# EAGLE design USB2Serial_MCP2200_v1.0 (EAGLE 9.6.2)
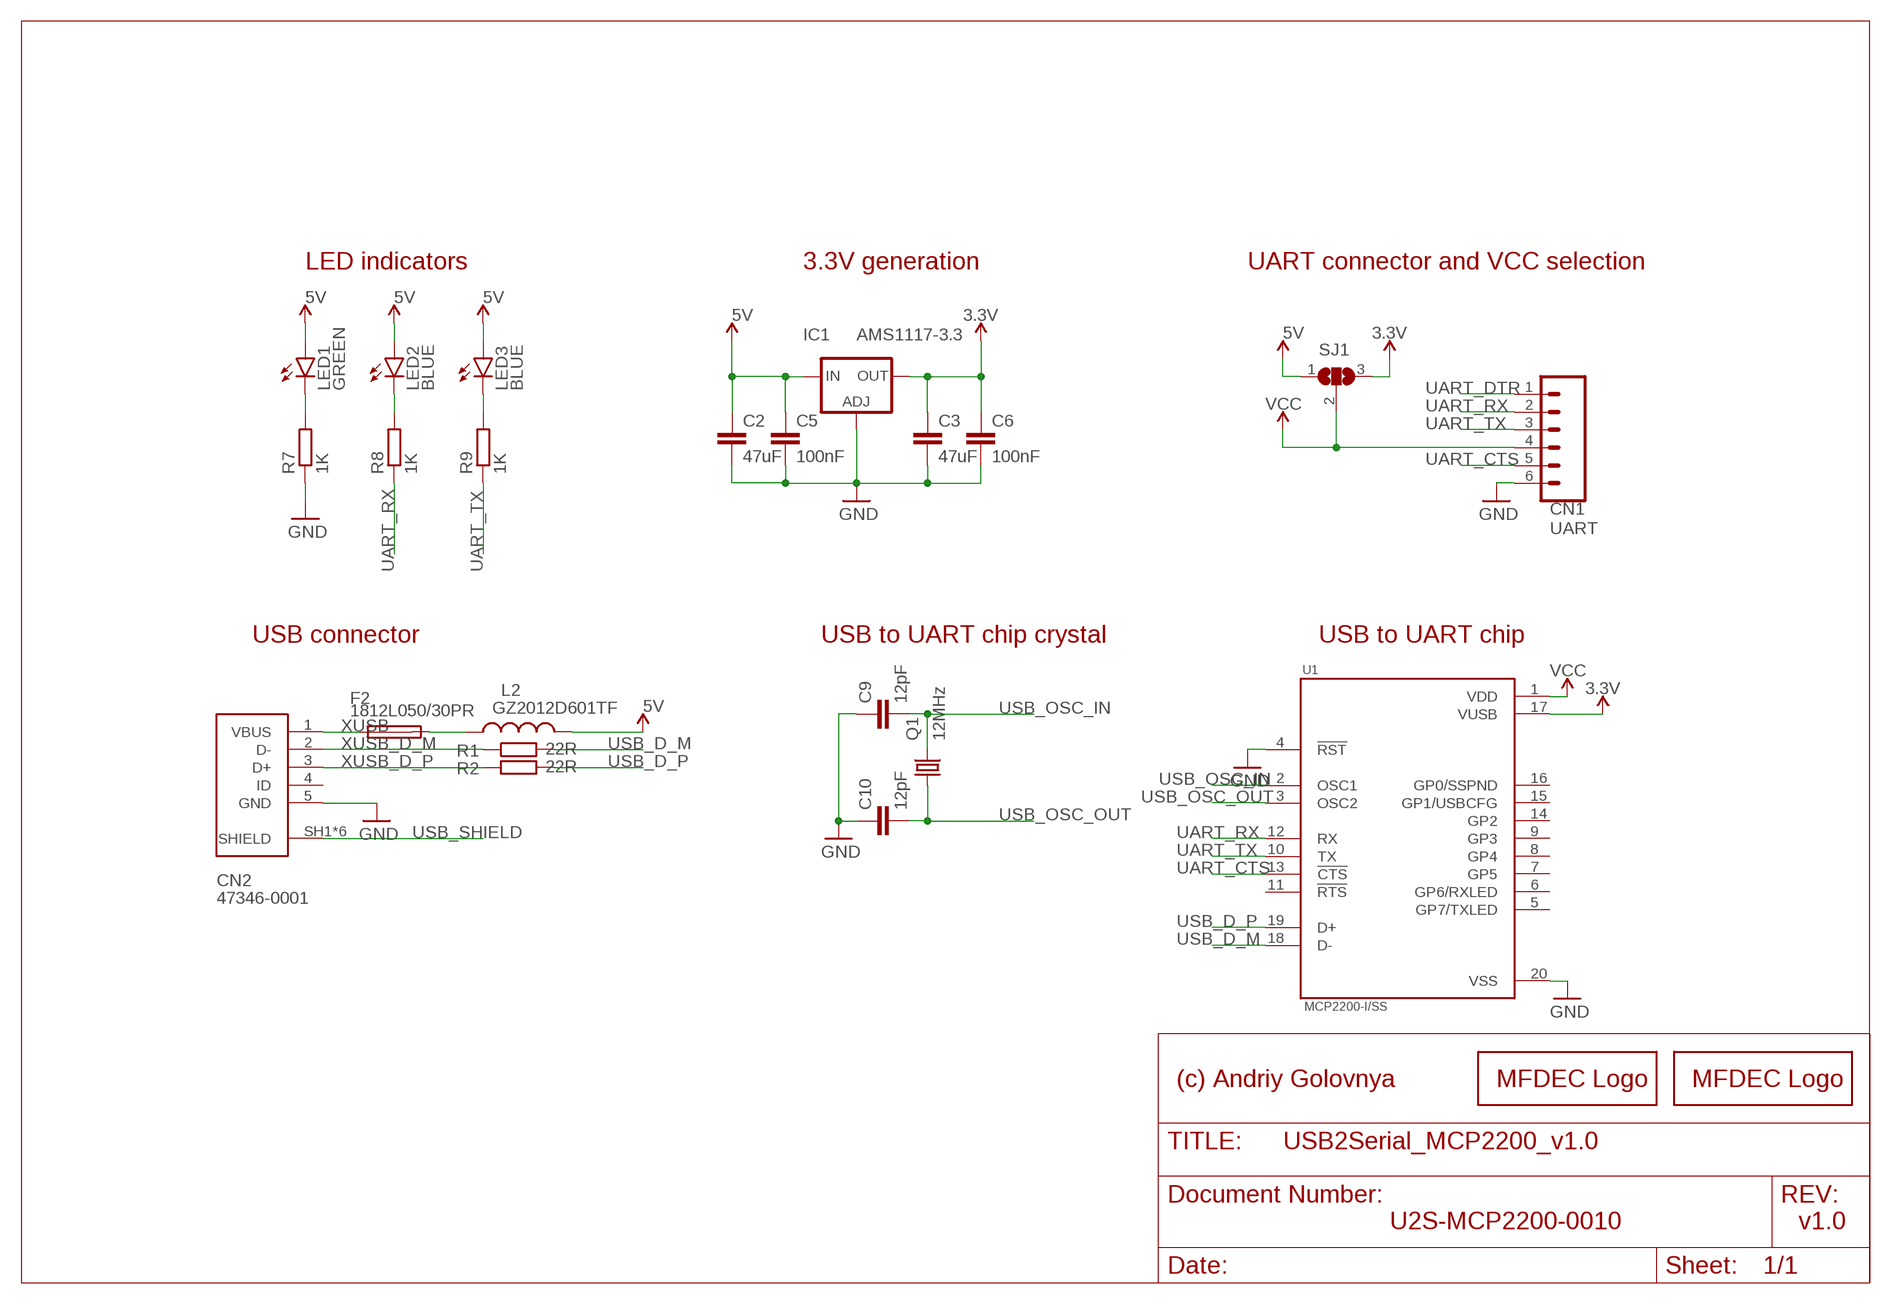
[diagram p0: schematic, sheet 1]

## Parts
C2  47uF  C-EUC0805  [C0805]
C3  47uF  C-EUC0805  [C0805]
C5  100nF  C-EUC0402  [C0402]
C6  100nF  C-EUC0402  [C0402]
C9  12pF  C-EUC0402  [C0402]
C10  12pF  C-EUC0402  [C0402]
CN1  UART  CONN_06LOCK  [1X06_LOCK]
CN2  47346-0001  [MOLEX_47346-0001]
F2  1812L050/30PR  MF-SMDF050  [MF-SMDF050]
IC1  AMS1117-3.3  LD117AS33TR  [SOT223]
L2  GZ2012D601TF  WE-CBA_0805_782853102_HC  [WE-CBA_0805(W=4)]
LED1  GREEN  LEDSML0603  [SML0603]
LED2  BLUE  LEDSML0603  [SML0603]
LED3  BLUE  LEDSML0603  [SML0603]
LOGO1  MFDECLOGO_L_20MM  [MFDEC_L_20MM]
LOGO2  MFDECLOGO_SQ_10MM  [MFDEC_SQ_10MM]
Q1  12MHz  KX-7  [3.2X2.5_KX-7]
R1  22R  R-EU_R0402  [R0402]
R2  22R  R-EU_R0402  [R0402]
R7  1K  R-EU_R0402  [R0402]
R8  1K  R-EU_R0402  [R0402]
R9  1K  R-EU_R0402  [R0402]
SJ1  SJ2FI  [SJ_2FI]
U1  MCP2200-I/SS  [SOP65P780X200-20N]

## Nets
3.3V [POWER]: C3.1 C6.1 IC1.4(OUT) SJ1.3 U1.17(VUSB)
5V [POWER]: C2.1 C5.1 IC1.3(IN) L2.2 LED1.A LED2.A LED3.A SJ1.1
GND [POWER]: C2.2 C3.2 C5.2 C6.2 C9.1 C10.1 CN1.6 CN2.5(GND) IC1.1(ADJ) R7.1 U1.4(!RST) U1.20(VSS)
N$4: F2.2 L2.1
N$7: LED1.C R7.2
N$9: LED3.C R9.2
N$10: LED2.C R8.2
UART_CTS: CN1.5 U1.13(!CTS)
UART_DTR: CN1.1
UART_RX: CN1.2 R8.1 U1.12(RX)
UART_TX: CN1.3 R9.1 U1.10(TX)
USB_D_M [USB]: R1.2 U1.18(D-)
USB_D_P [USB]: R2.2 U1.19(D+)
USB_OSC_IN: C9.2 Q1.3 U1.2(OSC1)
USB_OSC_OUT: C10.2 Q1.1 U1.3(OSC2)
USB_SHIELD: CN2.SH1(SHIELD) CN2.SH2(SHIELD) CN2.SH3(SHIELD) CN2.SH4(SHIELD) CN2.SH5(SHIELD) CN2.SH6(SHIELD)
VCC: CN1.4 SJ1.2 U1.1(VDD)
XUSB [POWER]: CN2.1(VBUS) F2.1
XUSB_D_M [XUSB]: CN2.2(D-) R1.1
XUSB_D_P [XUSB]: CN2.3(D+) R2.1
Unconnected: CN2.4(ID) U1.5(GP7/TXLED) U1.6(GP6/RXLED) U1.7(GP5) U1.8(GP4) U1.9(GP3) U1.11(!RTS) U1.14(GP2) U1.15(GP1/USBCFG) U1.16(GP0/SSPND)

## Notes on the sheet
- LED indicators | 3.3V generation | UART connector and VCC selection
- USB connector | USB to UART chip crystal | USB to UART chip
- (c) Andriy Golovnya
- U2S-MCP2200-0010 | v1.0

## Library data of the parts
C2 C3 C5 C6 C9 C10 = rcl:C-EU: CAPACITOR, European symbol; SPICEPREFIX: C
CN1 = _my_locked_connectors:CONN_06: Multi connection point. Often used as Generic Header-pin footprint for 0.1 inch spaced/style header connections On any of the 0.1 inch spaced packages, you can populate with these: Break Away Headers - Straight <https://www.sparkfun.com/products/116> (PRT-00116) Break Away Male Headers - Right Angle <https://www.sparkfun.com/products/553> (PRT-00553) Female Headers <https://www.sparkfun.com/products/115> (PRT-00115) Break Away Headers - Machine Pin <https://www.sparkfun.com/products/117> (PRT-00117) Break Away Female Headers - Swiss Machine Pin <https://www.sparkfun.com/products/743> (PRT-00743) Arduino Stackable Header - 6 Pin <https://www.sparkfun.com/products/9280> (PRT-09280) For SCREWTERMINALS and SPRING TERMINALS visit here: Screw Terimnals on SparkFun.com <https://www.sparkfun.com/search/results?term=Screw+Terminals> (5mm/3.5mm/2.54mm spacing) This device is also useful as a general connection point to wire up your design to another part of your project. Our various solder wires solder well into these plated through hole pads. Hook-Up Wire - Assortment (Stranded, 22 AWG) <https://www.sparkfun.com/products/11375> (PRT-11375) Hook-Up Wire - Assortment (Solid Core, 22 AWG) <https://www.sparkfun.com/products/11367> (PRT-11367) View the entire wire category on our website here <https://www.sparkfun.com/categories/141>
CN2 = SnapEDA-Library:47346-0001: CONN RCPT 5POS MICRO USB R/A SMD; MANUFACTURER: Molex
F2 = fuse:MF-SMDF: MF-SMDF Series - PRC Resettable Fuses Source: http://www.farnell.com/datasheets/716597.pdf
IC1 = v-reg:LD117A?*: Low drop fixed and adjustable positive voltage regulators 1 A Source: http://www.st.com/stonline/products/literature/ds/7194/ld1117axx.pdf
L2 = Wurth_Automotive_WE-CBA:WE-CBA_0805: WE-CBA SMD EMI Suppression Ferrite Bead Characteristics Reliable Ni-Sn electrodes High rated current up to 5A Recommended soldering: Reflow Operating temperature: -55°C to +125°C Applications * Perfect as data line filter and for uncoupling of distribution voltage *This special SMD chip bead ferrites can be put directly on the printed circuit board. They offer excellent anti-EMI properties and low DC-resistance. Placed very close next to the interference source even with smallest size 0402,maximal impedance at 1000 Ω can be reached. *High Speed: "High Speed " SMD ferrites WE-CBF have lower impedance in the lower frequency ranges thus they have only a low attenuation for fast signals. Application e.g. USB 2.0, IEEE 1394,LVDS *Wide Band: "Wide Band" SMD ferrites WE-CBF already show high impedance in low frequency range. Therefore they are wide band through the whole spectrum. Application e.g. control signats, RS232, RS422, DC/DC converter *High Current: "High Current " SMD ferrites WE-CBF are designed for high current (over 1 A). The rated current refers to 40K self-heating. High current SMD ferrites are available in all there types (High Speed, Wide Band and High Frequency). Application e.g. power supply, DC/DC converter *Advice: Pay attention for the use of SMD-Ferrites for high current>1A and ambient temperature over +85°C that the rated current has to be reduced when temperature is above +85°C (Derating). *At+100°C environment temperature the maximal rated current has to add up to only 60% of the data sheet value ,without an overload of the component. Variant abbreviation WB means WIDE BAND HS means HIGH SPEED HC means HIGH CURRENT <https://katalog.we-online.de/media/images/v2/o14751v209%20Family_WE-CBA.jpg> Details see: https://www.we-online.com/catalog/en/WE-CBA/ Updated by Ella Wu 2019-11-20 2019(C) Wurth Elektronik; DATASHEET-URL: https://www.we-online.com/catalog/datasheet/782853102.pdf; IR1: 1000mA; MOUNT: SMT; PART-NUMBER: 782853102; RDC-MAX: 0.3Ohm; TYPE: High Current; VALUE: 1000Ohm@100MHz; ZMAX: 1000Ohm
LED1-LED3 = led:LED: LED OSRAM: - CHIPLED LG R971, LG N971, LY N971, LG Q971, LY Q971, LO R971, LY R971 LH N974, LH R974 LS Q976, LO Q976, LY Q976 LO Q996 - Hyper CHIPLED LW Q18S LB Q993, LB Q99A, LB R99A - SideLED LS A670, LO A670, LY A670, LG A670, LP A670 LB A673, LV A673, LT A673, LW A673 LH A674 LY A675 LS A676, LA A676, LO A676, LY A676, LW A676 LS A679, LY A679, LG A679 - Hyper Micro SIDELED® LS Y876, LA Y876, LO Y876, LY Y876 LT Y87S - SmartLED LW L88C, LW L88S LB L89C, LB L89S, LG L890 LS L89K, LO L89K, LY L89K LS L896, LA L896, LO L896, LY L896 - TOPLED LS T670, LO T670, LY T670, LG T670, LP T670 LSG T670, LSP T670, LSY T670, LOP T670, LYG T670 LG T671, LOG T671, LSG T671 LB T673, LV T673, LT T673, LW T673 LH T674 LS T676, LA T676, LO T676, LY T676, LB T676, LH T676, LSB T676, LW T676 LB T67C, LV T67C, LT T67C, LS T67K, LO T67K, LY T67K, LW E67C LS E67B, LA E67B, LO E67B, LY E67B, LB E67C, LV E67C, LT E67C LW T67C LS T679, LY T679, LG T679 LS T770, LO T770, LY T770, LG T770, LP T770 LB T773, LV T773, LT T773, LW T773 LH T774 LS E675, LA E675, LY E675, LS T675 LS T776, LA T776, LO T776, LY T776, LB T776 LHGB T686 LT T68C, LB T68C - Hyper Mini TOPLED® LB M676 - Mini TOPLED Santana® LG M470 LS M47K, LO M47K, LY M47K Source: http://www.osram.convergy.de LUXEON: - LUMILED® LXK2-PW12-R00, LXK2-PW12-S00, LXK2-PW14-U00, LXK2-PW14-V00 LXK2-PM12-R00, LXK2-PM12-S00, LXK2-PM14-U00 LXK2-PE12-Q00, LXK2-PE12-R00, LXK2-PE12-S00, LXK2-PE14-T00, LXK2-PE14-U00 LXK2-PB12-K00, LXK2-PB12-L00, LXK2-PB12-M00, LXK2-PB14-N00, LXK2-PB14-P00, LXK2-PB14-Q00 LXK2-PR12-L00, LXK2-PR12-M00, LXK2-PR14-Q00, LXK2-PR14-R00 LXK2-PD12-Q00, LXK2-PD12-R00, LXK2-PD12-S00 LXK2-PH12-R00, LXK2-PH12-S00 LXK2-PL12-P00, LXK2-PL12-Q00, LXK2-PL12-R00 Source: www.luxeon.com KINGBRIGHT: KA-3528ASYC Source: www.kingbright.com
LOGO1 LOGO2 = _my_logos:MFDECLOGO: Midnight Fog - Digital Eye Candy LOGO
Q1 = crystal-geyer_V1_0:KX: Quartz Crystals (MHz) SMD: KX - Serie Model Size l/w/h [mm] Frequency Range Frequency Stability Temp. Range [°C] Load Capacitance AECQ 200 availabel Datasheet KX-4 KX-5 KX-6 KX-7 KX-9A KX-9B KX-12A KX-12B KX-13 KX-20 KX-K KX-KS 1.6/1.2/0.3 2.0/1.6/0.45 2.5/2.0/0.55 3.2/2.5/0.8 5.0/3.2/1.0 5.0/3.2/1.1 6.0/3.5/1.1 6.0/3.5/1.0 7.0/5.0 /1.3 11.6/5.5/1.6 12.3/4.5/4.2 12.3/4.5/3.2 24.0 ~ 80.0 MHz 16.0 ~ 80.0 MHz 12.0 ~ 80.0 MHz 8.0 ~ 60.0 MHz 7,68 ~ 300,0 MHz 8,0 ~ 50,0 MHz 8,0 ~ 150,0 MHz 8,0 ~ 50,0 MHz 6,0 ~ 160,0 MHz 3,579 ~ 25,0 MHz 3,579 ~ 70,0 MHz 3,579 ~ 70,0 MHz ±10 … ±50ppm ±10 … ±50ppm ±10 … ±50ppm ±10 … ±50ppm ±10 … ±50ppm ±10 … ±50ppm ±10 … ±50ppm ±10 … ±50ppm ±10 … ±50ppm ±50ppm ±10 … ±50ppm ±10 … ±50ppm (*) -40°C …+85°C (*) -40°C …+125°C (*) -40°C …+125°C (*) -40°C …+125°C (*) -40°C …+105°C (*) -40°C …+105°C (*) -40°C …+125°C (*) -40°C …+105°C (*) -40°C …+105°C (*) -40°C …+105°C (*) -40°C …+85°C (*) -40°C …+85°C 8, 8…16 8, 8…16 10, 8…16 12, 7…20 16, 10…20 16, 10…20 16, 10…20 16, 12…20 16, 12…20 16, 12…20 16, 12…30 16, 12…30 - yes yes yes - - - - - - - - KX-4.pdf <http://www.geyer-electronic.de/uploads/tx_userartikelfrequenz/GEYER-KX-4.pdf> KX-5.pdf <http://www.geyer-electronic.de/uploads/tx_userartikelfrequenz/GEYER-KX-5.pdf> KX-6.pdf <http://www.geyer-electronic.de/uploads/tx_userartikelfrequenz/GEYER-KX-6.pdf> KX-7.pdf <http://www.geyer-electronic.de/uploads/tx_userartikelfrequenz/GEYER-KX-7.pdf> KX-9A.pdf <http://www.geyer-electronic.de/uploads/tx_userartikelfrequenz/GEYER-KX-9A.pdf> KX-9B.pdf <http://www.geyer-electronic.de/uploads/tx_userartikelfrequenz/GEYER-KX-9B.pdf> KX-12A.pdf <http://www.geyer-electronic.de/uploads/tx_userartikelfrequenz/GEYER-KX-12A.pdf> KX-12B.pdf <http://www.geyer-electronic.de/uploads/tx_userartikelfrequenz/GEYER-KX-12B.pdf> KX-13.pdf <http://www.geyer-electronic.de/uploads/tx_userartikelfrequenz/GEYER-KX-13.pdf> KX-20.pdf <http://www.geyer-electronic.de/uploads/tx_userartikelfrequenz/GEYER-KX-20.pdf> KX-K.pdf <http://www.geyer-electronic.de/uploads/tx_userartikelfrequenz/GEYER-KX-K.pdf> KX-KS.pdf <http://www.geyer-electronic.de/uploads/tx_userartikelfrequenz/GEYER-KX-KS.pdf> <http://www.geyer-electronic.de/fileadmin/template/img/logo-geyer-electronic.png> Details see: http://www.geyer-electronic.de/Frequenz-Produkte.9.0.html Created 2016-06-07, Hans Locher 2016 (C) Geyer Quartz Technology KX4,KX5,KX6,KX7,KX9A,KX9B,KX12A,KX12B,KX13,KX20,KXK,KXKS;1612;2016;2520;3225;5032;6035;7050;11655;12345;1,6x1,2;2,0x1,6;2,5x2,0;3,2x2,5;5,0x3,2;6,0x3,5;7,0x5,0;11,6x5,5;12,3x4,5;12,3x4,5;1.6x1.2;2.0x1.6;2.5x2.0;3.2x2.5;5.0x3.2;6.0x3.5;7.0x5.0;11.6x5.5;12.3x4.5;12.3x4.5;
R1 R2 R7-R9 = rcl:R-EU_: RESISTOR, European symbol; SPICEPREFIX: R
SJ1 = _my_jumpers:SJ2: SMD solder JUMPER SJ2 - simple jumper SJ2FI - fancy inside jumper SJ2FO - fancy outside jumper SJ2FL - fancy left jumper SJ2FR - fancy right jumper SJ2W - wide jumper
U1 = MCP2200-I_SS:MCP2200-I: MCP2200 Series 5.5 V 8 Channel USB to UART Serial Converter SMT- SSOP-20LD Check availability <https://pricing.snapeda.com/parts/MCP2200-I/SS/Microchip/view-part?ref=eda>; AVAILABILITY: In Stock; DESCRIPTION: USB Bridge, USB to UART USB 2.0 UART Interface 20-SSOP; MF: Microchip; MP: MCP2200-I/SS; PACKAGE: SSOP-20 Microchip; PRICE: None; PURCHASE-URL: https://pricing.snapeda.com/search/part/MCP2200-I/SS/?ref=eda

## Net classes
1 XUSB: width 0.305 mm
2 USB: width 0.305 mm
3 POWER: width 0.305 mm

## Board
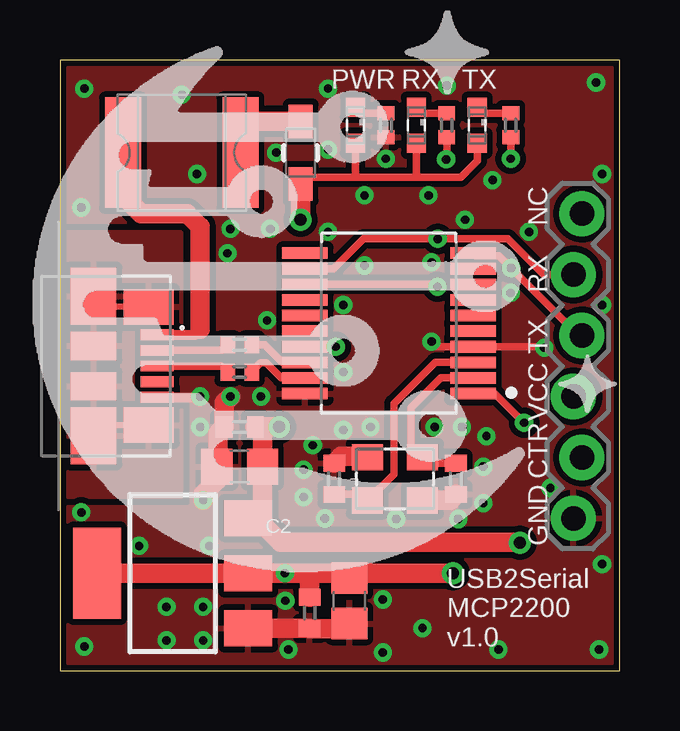
[diagram p1: board, top side]
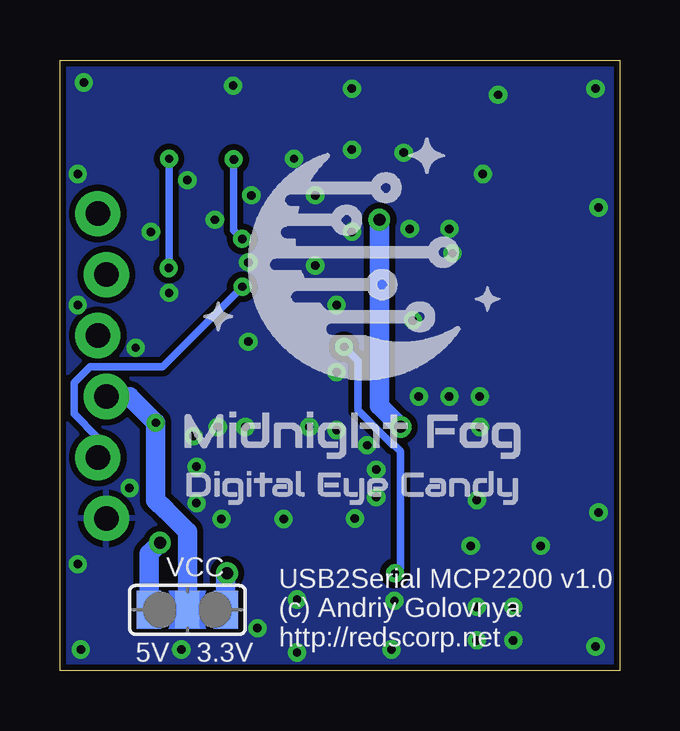
[diagram p2: board, bottom side, seen from below]

Size 23.35 x 25.45 mm. Coordinates in mm from the lower left corner, seen from the top.
Outline: 0,0 23.35,0 23.35,25.45 0,25.45 0,0
Copper layers (1*16): Top 0.035mm / dielectric 1.5mm / Bottom 0.035mm
Design rules "default *": minimum track width 6mil, minimum drill 0.35mm, track to track 6mil, track to pad 6mil, pad to pad 6mil, via to via 6mil, smd to smd 6mil, copper to edge 10mil, drill to drill 6mil, minimum pad ring 10mil, minimum via ring 8mil, stop-mask expansion 4mil, vias tented up to drill 20mil, thermal gap 10mil

### Footprints (pad centres in the part's own frame; a part is rotated, then mirrored left to right if it is on the bottom)
C0805 = smd 1.3 x 1.5: 1 -0.95,0; 2 0.95,0
C0402 = smd 0.7 x 0.9: 1 -0.65,0; 2 0.65,0
1X06_LOCK = drill 1.016 pad 1.88: 1 0,0.178; 2 2.54,-0.178; 3 5.08,0.178; 4 7.62,-0.178; 5 10.16,0.178; 6 12.7,-0.178
MOLEX_47346-0001 = smd 0.45 x 1.38: 1 -1.3,2.66; 2 -0.65,2.66; 3 0,2.66; 4 0.65,2.66; 5 1.3,2.66 | smd 1.475 x 2.1: SH1 -2.462,2.3; SH2 2.462,2.3 | smd 2.375 x 1.9: SH3 -2.913,0; SH6 2.913,0 | smd 1.175 x 1.9: SH4 -0.838,0; SH5 0.838,0
MF-SMDF050 = smd 1.5 x 4.6: 1 -2.45,0; 2 2.45,0
SOT223 = smd 1.5 x 2: 1 -2.3,-3.15; 2 0,-3.15; 3 2.3,-3.15 | smd 3.8 x 2: 4 0,3.15
WE-CBA_0805(W=4) = smd 1.4 x 1: 1 -1.3,0; 2 1.3,0
SML0603 = smd 0.8 x 0.8: A 0.75,0; C -0.75,0
3.2X2.5_KX-7 = smd 1.3 x 1.1: 1 -1.15,-0.9; 2 1.15,-0.9; 3 1.15,0.9; 4 -1.15,0.9
R0402 = smd 0.6 x 0.7: 1 -0.5,0; 2 0.5,0
SJ_2FI = smd 1.016 x 1.575: 1 -1.6,0; 2 0,0; 3 1.6,0
SOP65P780X200-20N = smd 1.9 x 0.48: 1 -3.505,2.925; 2 -3.505,2.275; 3 -3.505,1.625; 4 -3.505,0.975; 5 -3.505,0.325; 6 -3.505,-0.325; 7 -3.505,-0.975; 8 -3.505,-1.625; 9 -3.505,-2.275; 10 -3.505,-2.925; 11 3.505,-2.925; 12 3.505,-2.275; 13 3.505,-1.625; 14 3.505,-0.975; 15 3.505,-0.325; 16 3.505,0.325; 17 3.505,0.975; 18 3.505,1.625; 19 3.505,2.275; 20 3.505,2.925

### Placement (x,y rotation side)
C2  7.49,8.51 180 top
C3  12.06,2.92 270 top
C5  7.49,10.16 180 top
C6  10.41,2.41 270 top
C9  16.51,8 90 top
C10  11.43,8 270 top
CN1  21.59,19.05 270 top
CN2  1.4,12.7 270 top
F2  5.08,21.59 0 top
IC1  4.7,4.06 90 top
L2  10.03,21.59 270 top
LED1  12.32,22.73 270 top
LED2  14.86,22.73 270 top
LED3  17.4,22.73 270 top
LOGO1  -6.99,2.29 0 top  (outside the outline)
LOGO2  19.18,6.48 0 bottom
Q1  13.97,8 0 top
R1  7.49,13.59 0 top
R2  7.49,12.45 0 top
R7  13.59,22.73 90 top
R8  16.13,22.73 90 top
R9  18.8,22.73 90 top
SJ1  18.03,2.54 0 bottom
U1  13.72,14.48 180 top

### Tracks (layer width: path | path; a pad name or v marks a point on that pad's centre or on a via)
3.3V  (via drill 0.35, 0.5)
  Top 0.305: U1.17 v11.5,13.5
  Top 0.813: v16.38,4.06 12.26,4.06 C3.1 11.87,4.06 10.41,4.06 | IC1.4 v9.38,4.06 10.41,4.06 | C6.1 10.41,4.06
  Bottom 0.305: v11.5,13.5 10.92,12.92 10.92,10.86 9.46,9.4 9.4,9.4 9.14,9.14 9.14,4.3 v9.38,4.06
  Bottom 0.813: v16.38,4.06 16.43,4.01 SJ1.3
5V  (via drill 0.5)
  Top 0.305: LED3.A 17.4,21.26 16.71,20.57 14.86,20.57 | L2.2 10.32,20.57 12.32,20.57 | 14.86,20.57 12.32,20.57 | LED1.A 12.32,20.57 | LED2.A 14.86,20.57
  Top 0.813: L2.2 v10.03,18.8 | v19.18,5.33 19.15,5.36 9.2,5.36 8.51,6.05 8.51,6.1 8.24,6.36 | 8.24,6.36 IC1.3 | v9.14,10.16 C5.1 8.44,9.86 C2.1 8.44,6.57 8.24,6.36
  Bottom 0.813: v10.03,18.8 10.03,17.53 10.03,11.05 v9.14,10.16 | v19.18,5.33 19.63,4.88 SJ1.1
GND  (via drill 0.35)
  Top 0.305: v15.49,13.72 15.71,13.5 U1.4 20.15,13.5 v20.19,13.46
  Top 0.406: CN2.5 5.75,11.4 5.84,11.3
  Top 0.813: C3.2 12.27,1.76 C6.2 IC1.1 | C10.1 11.72,8.94 13.08,8.94 | C9.1 16.27,7.11 14.99,7.11 | v7.11,11.43 6.84,11.16 C5.2 6.59,9.91 6.59,8.55 C2.2 6.54,7.94 5.97,7.37 v5.97,7.11
  other vias: 5.84,11.43 5.84,10.16 13.59,21.34 11.18,21.72 9.02,21.59 5.71,20.7 5.08,24 1.02,24.26 0.89,19.3 11.18,24.26 22.35,24.51 16.13,24.38 22.61,20.7 22.48,0.89 1.02,1.02 9.53,0.89 5.97,1.27 5.97,2.67 4.45,1.27 4.45,2.67 15.11,1.78 18.29,0.89 13.46,0.76 0.89,6.6 6.22,5.21 3.3,5.21 20.45,7.62 22.61,4.45 9.4,2.92 8.38,11.43 7.11,18.41 12.7,16.89 15.49,17.02 16.89,18.8 18.03,20.45 15.37,19.81 11.18,18.29 12.7,19.81 18.8,15.75 22.61,15.24 19.56,18.29 17.65,6.99 17.65,8.51 15.62,10.16 16.76,10.16 17.78,9.78 12.95,10.16 11.81,10.03 10.54,9.4 10.16,8.38 10.16,7.24 11.05,6.35 14.02,6.32 16.61,6.32 13.46,2.97 8.64,14.61 8.76,18.41 6.99,17.4 11.81,15.24 11.81,12.45
  pour Top (isolate 0.254, rank 2): 0,0 25.15,0 25.15,25.4 0,25.4
  pour Bottom (isolate 0.254, rank 2): 0,0 23.37,0 23.37,26.54 0,26.54
N$4
  Top 0.813: L2.1 8.07,22.89 7.53,22.35 F2.2
N$7
  Top 0.305: LED1.C 12.57,23.23 R7.2
N$9
  Top 0.305: LED3.C 17.65,23.23 R9.2
N$10
  Top 0.305: LED2.C 15.11,23.23 R8.2
UART_CTS  (via drill 0.35)
  Top 0.305: U1.13 15.64,16.1 v15.74,16
  Bottom 0.305: CN1.5 21.77,9.72 22.76,10.71 22.76,12 22.08,12.68 19.07,12.68 v15.74,16
UART_RX  (via drill 0.35)
  Top 0.305: R8.1 16.13,21.34 v16.1,21.31 | U1.12 11.4,16.75 12.65,18 v15.75,18 18.68,18 20.17,16.51 CN1.2
  Bottom 0.305: v16.1,21.31 16.1,18.35 v15.75,18
UART_TX  (via drill 0.35)
  Top 0.305: R9.1 v18.8,21.34 | U1.10 17.33,17.3 18.3,17.3 v18.81,16.78 21.62,13.97 CN1.3
  Bottom 0.305: v18.8,21.34 18.8,16.8 v18.81,16.78
USB_D_M
  Top 0.305: 7.99,13.65 R1.2 8.53,13.59 9.26,12.85 U1.18
USB_D_P
  Top 0.305: R2.2 8.37,12.83 8.6,12.83 9.23,12.2 U1.19
USB_OSC_IN
  Top 0.305: Q1.3 15.04,8.9 | Q1.3 15.37,8.65 C9.2 | U1.2 15.89,12.2 14.64,10.95 14.64,9.38 Q1.3
USB_OSC_OUT
  Top 0.305: C10.2 12.57,7.35 Q1.1 13.92,8.19 13.92,11.12 15.65,12.85 U1.3
USB_SHIELD
  Top 0.254: CN2.SH2 1.85,10.24 CN2.SH6 | CN2.SH1 1.85,15.16 CN2.SH3
  pour Top (isolate 0.254): 3.3,14.48 5.08,14.48 5.08,18.29 0,18.29 0,7.24 5.08,7.24 5.08,10.92 3.05,10.92 3.05,14.48 3.17,14.48
VCC  (via drill 0.35)
  Top 0.305: U1.1 18.13,11.55 v19.35,10.34
  Bottom 0.813: SJ1.2 18.03,5.79 18.95,6.7 19.35,7.11 v19.35,10.34 20.45,11.43 CN1.4
XUSB
  Top 0.406: CN2.1 5.62,14 5.84,14.22
  Top 0.813: 5.84,14.22 5.84,18.5 5.3,19.05 3.39,19.05 2.63,19.81 F2.1
XUSB_D_M
  Top 0.305: CN2.2 6.75,13.35 R1.1
XUSB_D_P
  Top 0.305: CN2.3 6.74,12.7 R2.1

### Text on the board
tPlace: PWR | RX | TX | NC | RX | TX | VCC | CTR | GND | USB2Serial / MCP2200 / v1.0
bPlace: VCC | USB2Serial MCP2200 v1.0 / (c) Andriy Golovnya / http://redscorp.net | 3.3V | 5V